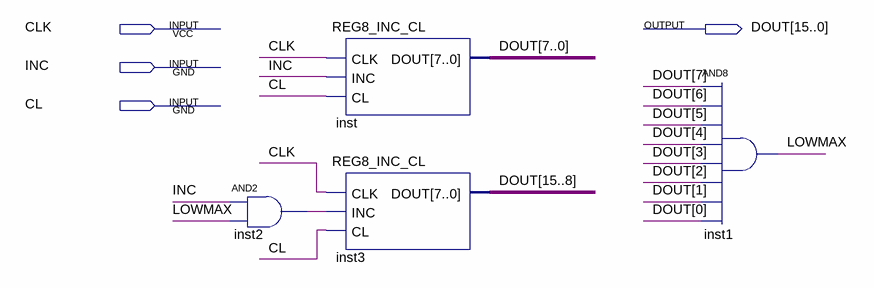
[diagram p0: schematic sheet]
// Quartus schematic REG16_INC_CL.bdf as structural Verilog: 4 symbols, 4 pins
module REG16_INC_CL (
  input  CLK,
  input  INC,
  input  CL,
  output [15:0] DOUT
);

  wire inst2_out, LOWMAX;

  and inst2 (inst2_out, INC, LOWMAX);
  REG8_INC_CL inst (.CLK(CLK), .INC(INC), .CL(CL), .DOUT(DOUT[7:0]));
  REG8_INC_CL inst3 (.CLK(CLK), .INC(inst2_out), .CL(CL), .DOUT(DOUT[15:8]));
  and inst1 (LOWMAX, DOUT[7], DOUT[6], DOUT[5], DOUT[4], DOUT[3], DOUT[2], DOUT[1], DOUT[0]);
endmodule
